# Altium schematic sheet Controller_1.SchDoc
size A4
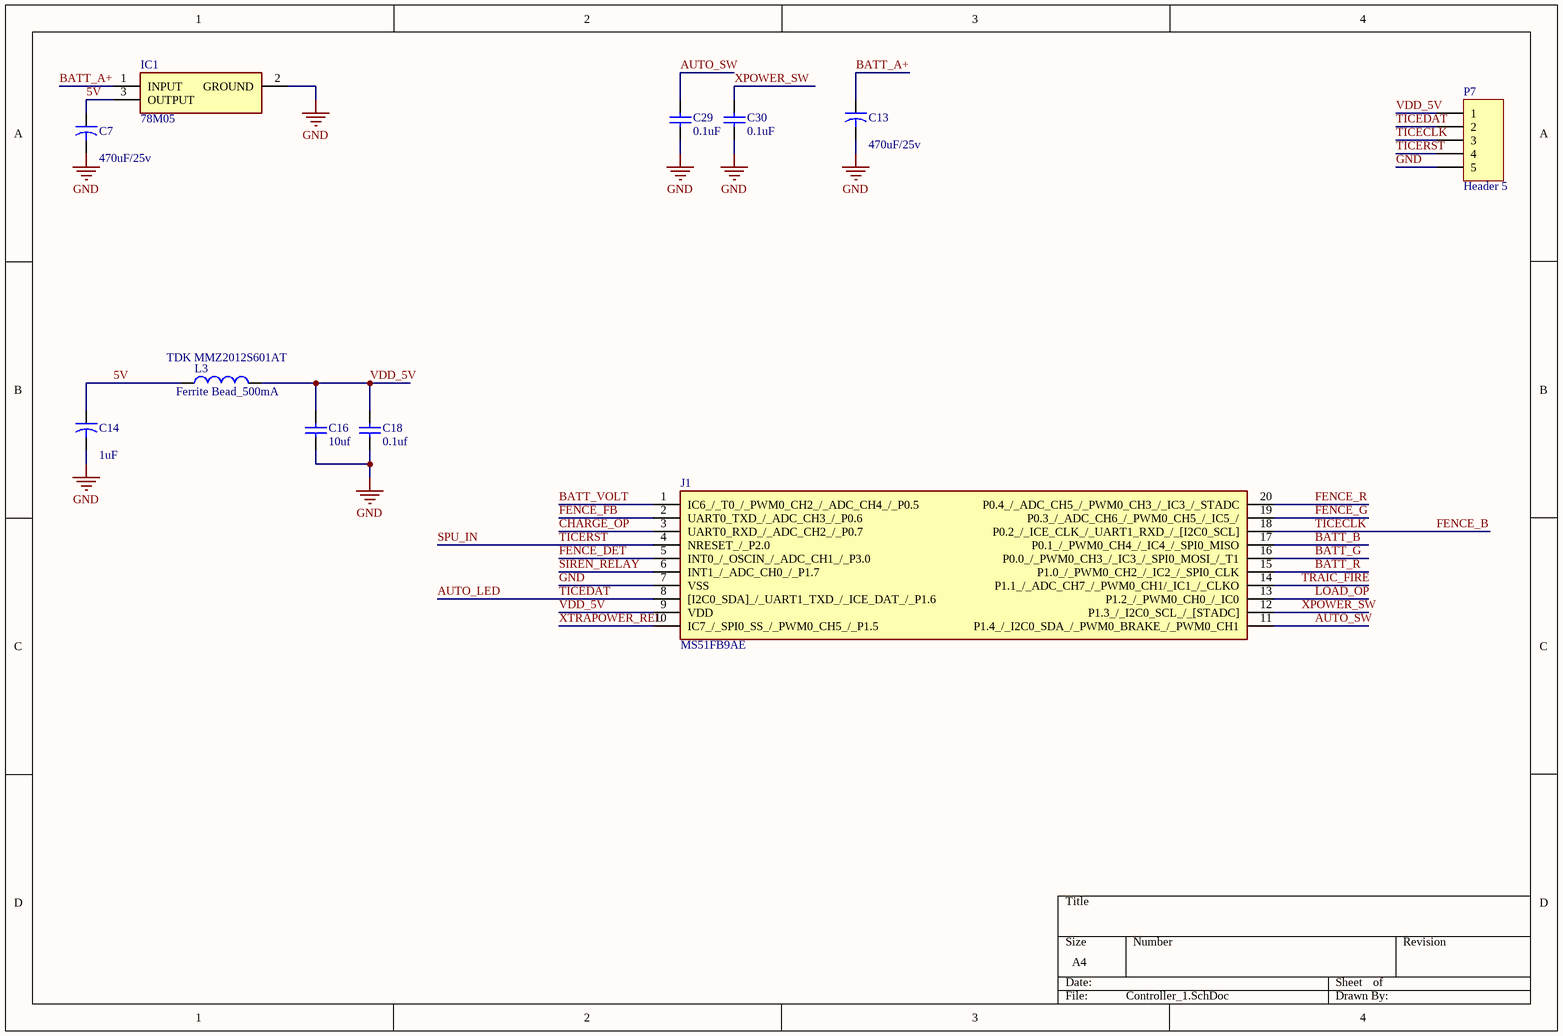
[diagram p0: Controller_1.SchDoc]

## Parts
C7  value 470uF/25v  [Cap_470uf_10X10.2mm]  (hidden comment: Cap2)
C13  value 470uF/25v  [Cap_470uf_10X10.2mm]  (hidden comment: Cap2)
C14  value 1uF  [0805]  (hidden comment: Cap2)
C16  value 10uf  [0805]  (hidden comment: Cap)
C18  value 0.1uf  [0805]  (hidden comment: Cap)
C29  value 0.1uF  [0805]  (hidden comment: Cap)
C30  value 0.1uF  [0805]  (hidden comment: Cap)
IC1  78M05  [TS78M05CP]
J1  MS51FB9AE  [SOP65P640X120-20N]
L3  Ferrite Bead_500mA  value TDK MMZ2012S601AT  [0805]
P7  Header 5  [HEADER 2.5MM 5PIN]

## Nets
GND: C7.2 C13.2 C14.2 C16.1 C18.1 C29.2 C30.2 IC1.2(GROUND) J1.7(VSS) P7.5
5V: C7.1 C14.1 IC1.3(OUTPUT) L3.1
AUTO_LED: J1.8([I2C0_SDA]_/_UART1_TXD_/_ICE_DAT_/_P1.6) P7.2  [also labelled TICEDAT]
AUTO_SW: C29.1 J1.11(P1.4_/_I2C0_SDA_/_PWM0_BRAKE_/_PWM0_CH1)
BATT_A+: C13.1 IC1.1(INPUT)
BATT_B: J1.17(P0.1_/_PWM0_CH4_/_IC4_/_SPI0_MISO)
BATT_G: J1.16(P0.0_/_PWM0_CH3_/_IC3_/_SPI0_MOSI_/_T1)
BATT_R: J1.15(P1.0_/_PWM0_CH2_/_IC2_/_SPI0_CLK)
BATT_VOLT: J1.1(IC6_/_T0_/_PWM0_CH2_/_ADC_CH4_/_P0.5)
CHARGE_OP: J1.3(UART0_RXD_/_ADC_CH2_/_P0.7)
FENCE_B: J1.18(P0.2_/_ICE_CLK_/_UART1_RXD_/_[I2C0_SCL]) P7.3  [also labelled TICECLK]
FENCE_DET: J1.5(INT0_/_OSCIN_/_ADC_CH1_/_P3.0)
FENCE_FB: J1.2(UART0_TXD_/_ADC_CH3_/_P0.6)
FENCE_G: J1.19(P0.3_/_ADC_CH6_/_PWM0_CH5_/_IC5_/)
FENCE_R: J1.20(P0.4_/_ADC_CH5_/_PWM0_CH3_/_IC3_/_STADC)
LOAD_OP: J1.13(P1.2_/_PWM0_CH0_/_IC0)
SIREN_RELAY: J1.6(INT1_/_ADC_CH0_/_P1.7)
SPU_IN: J1.4(NRESET_/_P2.0) P7.4  [also labelled TICERST]
TRAIC_FIRE: J1.14(P1.1_/_ADC_CH7_/_PWM0_CH1/_IC1_/_CLKO)
VDD_5V: C16.2 C18.2 J1.9(VDD) L3.2 P7.1
XPOWER_SW: C30.1 J1.12(P1.3_/_I2C0_SCL_/_[STADC])
XTRAPOWER_REL: J1.10(IC7_/_SPI0_SS_/_PWM0_CH5_/_P1.5)

## Library data of the parts
C7 C13 C14 = Cap2: Capacitor; Published: 23-Sep-2002; PackageReference: CAPR5-4X5; Publisher: Altium Limited; PackageDescription: Capacitor; 2 Leads
C16 C18 C29 C30 = Cap: Capacitor; Published: 8-Jun-2000; LatestRevisionDate: 17-Jul-2002; LatestRevisionNote: Re-released for DXP Platform.; PackageReference: RAD-0.3; Publisher: Altium Limited; PackageDescription: Radial Cap, Thru-Hole; 2 Leads; 0.3 in Pin Spacing
IC1 = TS78M05CP: Integrated Circuit; Manufacturer_Name: Taiwan Semiconductor; Datasheet Link: https://componentsearchengine.com/Datasheets/1/TS78M05CP.pdf; Height: 2.38mm; Manufacturer_Part_Number: TS78M05CP; Mouser Part Number: 821-TS78M05CP; Mouser Price/Stock: https://www.mouser.com/Search/Refine.aspx?Keyword=821-TS78M05CP
J1 = MS51FB9AE: Controller; Manufacturer_Name: Nuvotem Talema; Datasheet Link: https://www.nuvoton.com/export/resource-files/TRM_MS51_16KBFlash_Series_EN_Rev1.01.pdf; Height: 1.2mm; Manufacturer_Part_Number: MS51FB9AE
L3 = Inductor: Code_IEC: 1005; Published: 8-Jun-2000; LatestRevisionDate: 29-May-2009; LatestRevisionNote: IPC-7351 Footprint Added.; PackageReference: 0402-A; Publisher: Altium Limited; PackageDescription: Chip Inductor; Code_JEITA: 0402
P7 = Header 5: Header, 5-Pin; LatestRevisionDate: 17-Jul-2002; LatestRevisionNote: Re-released for DXP Platform.; Publisher: Altium Limited